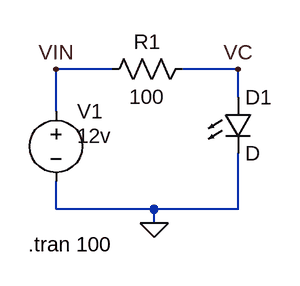
[diagram p0: schematic resistor.asc]
resistor.asc, the LTspice schematic file:
Version 4.1
SHEET 1 880 680
WIRE -208 384 -272 384
WIRE -64 384 -128 384
WIRE -64 416 -64 384
WIRE -272 432 -272 384
WIRE -272 544 -272 512
WIRE -160 544 -272 544
WIRE -64 544 -64 480
WIRE -64 544 -160 544
WIRE -160 560 -160 544
FLAG -160 560 0
FLAG -64 384 VC
FLAG -272 384 VIN
SYMBOL voltage -272 416 R0
WINDOW 3 24 44 Left 2
WINDOW 123 0 0 Left 0
WINDOW 39 0 0 Left 0
SYMATTR InstName V1
SYMATTR Value 12v
SYMBOL res -112 368 R90
WINDOW 0 0 56 VBottom 2
WINDOW 3 32 56 VTop 2
SYMATTR InstName R1
SYMATTR Value 100
SYMBOL LED -80 416 R0
SYMATTR InstName D1
TEXT -304 584 Left 2 !.tran 100

The netlist it stands for:
* resistor.asc
V1 VIN 0 12v
R1 VC VIN 100
D1 VC 0 D
.model D D
.lib standard.dio
.tran 100
.backanno
.end